# Altium schematic sheet sim.SchDoc
size A4
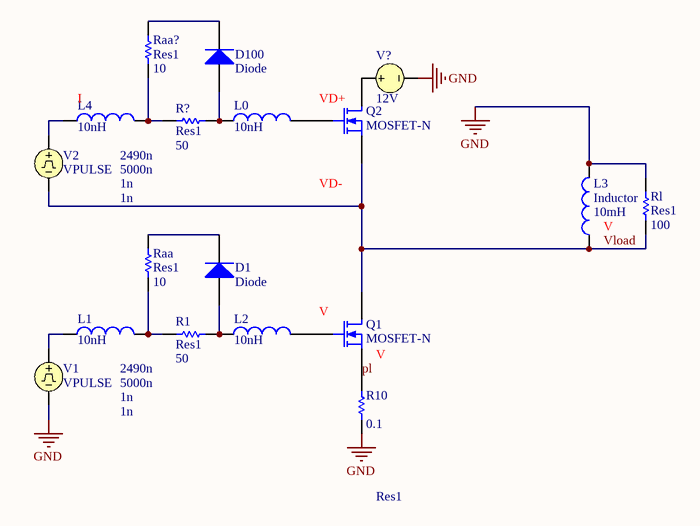
[diagram p0: sim.SchDoc]

## Parts
D1  Diode  [SMC]
D100  Diode  [SMC]
L0  value 10nH  [0402-A]  (hidden comment: Inductor)
L1  value 10nH  [0402-A]  (hidden comment: Inductor)
L2  value 10nH  [0402-A]  (hidden comment: Inductor)
L3  Inductor  value 10mH  [0402-A]
L4  value 10nH  [0402-A]  (hidden comment: Inductor)
Q1  MOSFET-N  [E3]
Q2  MOSFET-N  [E3]
R1  Res1  value 50  [AXIAL-0.3]
R10  Res1  value 0.1  [AXIAL-0.3]
R?  Res1  value 50  [AXIAL-0.3]
Raa  Res1  value 10  [AXIAL-0.3]
Raa?  Res1  value 10  [AXIAL-0.3]
Rl  Res1  value 100  [AXIAL-0.3]
V1  VPULSE  Rise Time: 1n  Pulse Width: 2490n  Period: 5000n
V2  VPULSE  Rise Time: 1n  Pulse Width: 2490n  Period: 5000n
V?  12V

## Nets
GND: L3.2 R10.1 Rl.2 V1.2 V?.2
pl: Q1.3(S) R10.2
Vload: L3.1 Q1.1(D) Q2.3(S) Rl.1 V2.2
NetD1_1: D1.1(A) L2.1 R1.2
NetD1_2: D1.2(K) Raa.2
NetD100_1: D100.1(A) L0.1 R?.2
NetD100_2: D100.2(K) Raa?.2
NetL0_2: L0.2 Q2.2(G)
NetL1_1: L1.1 V1.1
NetL1_2: L1.2 R1.1 Raa.1
NetL2_2: L2.2 Q1.2(G)
NetL4_1: L4.1 V2.1
NetL4_2: L4.2 R?.1 Raa?.1
NetQ2_1: Q2.1(D) V?.1

## Library data of the parts
D1 D100 = Diode: Default Diode; Published: 8-Jun-2000; LatestRevisionDate: 17-Jul-2002; LatestRevisionNote: Re-released for DXP Platform.; PackageVersion: Sep-1996; PackageReference: SMC; Publisher: Altium Limited; PackageDescription: DO-214-AB/SMC; 2 C-Bend Leads; Body 7.9 x 5.9 mm, inc. leads (LxW); Code_JEDEC: DO-214-AB
L0-L4 = Inductor: Code_IEC: 1005; Published: 8-Jun-2000; LatestRevisionDate: 29-May-2009; LatestRevisionNote: IPC-7351 Footprint Added.; PackageReference: 0402-A; Publisher: Altium Limited; PackageDescription: Chip Inductor; Code_JEITA: 0402
Q1 Q2 = MOSFET-N: N-Channel MOSFET; Published: 8-Jun-2000; LatestRevisionDate: 17-Jul-2002; LatestRevisionNote: Re-released for DXP Platform.; PackageVersion: 1995/1996; PackageReference: E3; Publisher: Altium Limited; PackageDescription: TO, Flat Index; 3 In-Line, Axial Leads; Body Dia. 4.6mm; Lead Dia. 0.5 mm (max)
R1 R10 R? Raa Raa? Rl = Res1: Resistor; Published: 8-Jun-2000; LatestRevisionDate: 17-Jul-2002; LatestRevisionNote: Re-released for DXP Platform.; PackageReference: AXIAL-0.3; Publisher: Altium Limited; PackageDescription: Axial Device, Thru-Hole; 2 Leads; 0.3 in Pin Spacing
V1 V2 = VPULSE: Pulse Voltage Source; Note: PCB Footprint - Not required; Published: 8-Jun-2000; LatestRevisionDate: 15-Nov-2004; LatestRevisionNote: Corrected Netlist.; PackageReference: Not Applicable; Publisher: Altium Limited; Fall Time: 1n
V? = VSRC: Voltage Source; Note: PCB Footprint - Not required; Value: 12; Published: 8-Jun-2000; LatestRevisionDate: 17-Jul-2002; LatestRevisionNote: Re-released for DXP Platform.; PackageReference: Not Applicable; Publisher: Altium Limited